# EAGLE design apc556fix (EAGLE 9.6.0)
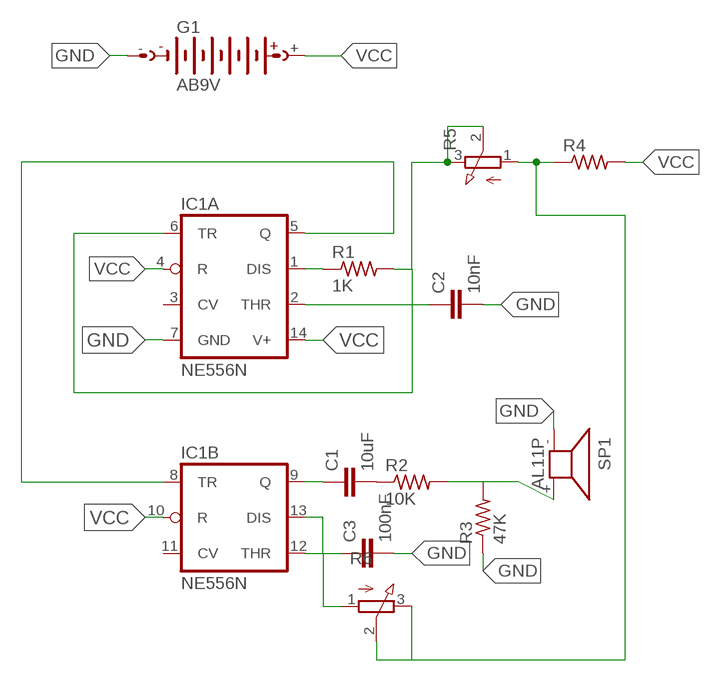
[diagram p0: schematic, sheet 1]

## Parts
C1  10uF  C-EU025-030X050  [C025-030X050]
C2  10nF  C-EU025-030X050  [C025-030X050]
C3  100nF  C-EU025-030X050  [C025-030X050]
G1  AB9V  [AB9V]
IC1  NE556N  [DIL14]
R1  1K  R-US_0204/5  [0204/5]
R2  10K  R-US_0204/7  [0204/7]
R3  47K  R-US_0204/7  [0204/7]
R4  R-US_0204/7  [0204/7]
R5  3RP/1610N  [3RP/1610N]
R6  3RP/1610N  [3RP/1610N]
SP1  AL11P  [AL11P]

## Nets
GND: C2.2 C3.2 G1.- IC1.7(A:GND) R3.1 SP1.-
N$1: IC1.5(A:Q) IC1.8(B:TR)
N$2: C2.1 IC1.2(A:THR) IC1.6(A:TR) R1.2 R5.2(S) R5.3(E)
N$3: IC1.1(A:DIS) R1.1
N$4: C1.1 IC1.9(B:Q)
N$5: C1.2 R2.1
N$6: R2.2 R3.2 SP1.+
N$7: C3.1 IC1.12(B:THR) IC1.13(B:DIS) R6.1(A)
N$9: R4.1 R5.1(A) R6.2(S) R6.3(E)
VCC: G1.+ IC1.4(A:R) IC1.10(B:R) IC1.14(A:V+) R4.2
Unconnected: IC1.3(A:CV) IC1.11(B:CV)

## Library data of the parts
C1-C3 = resistor:C-EU: CAPACITOR, European symbol
G1 = battery:AB9V: 9-V BATTERY CLIP
IC1 = linear:*556: Dual TIMER
R1-R4 = resistor:R-US_: RESISTOR, American symbol
R5 R6 = pot:3RP/1610N: 16mm Potentiometer one level Source: http://www.alphapotentiometers.net/html/16mm_pot_2.html
SP1 = buzzer:AL11P: SPEAKER Source: Buerklin; OC_FARNELL: unknown; OC_NEWARK: unknown

## Board
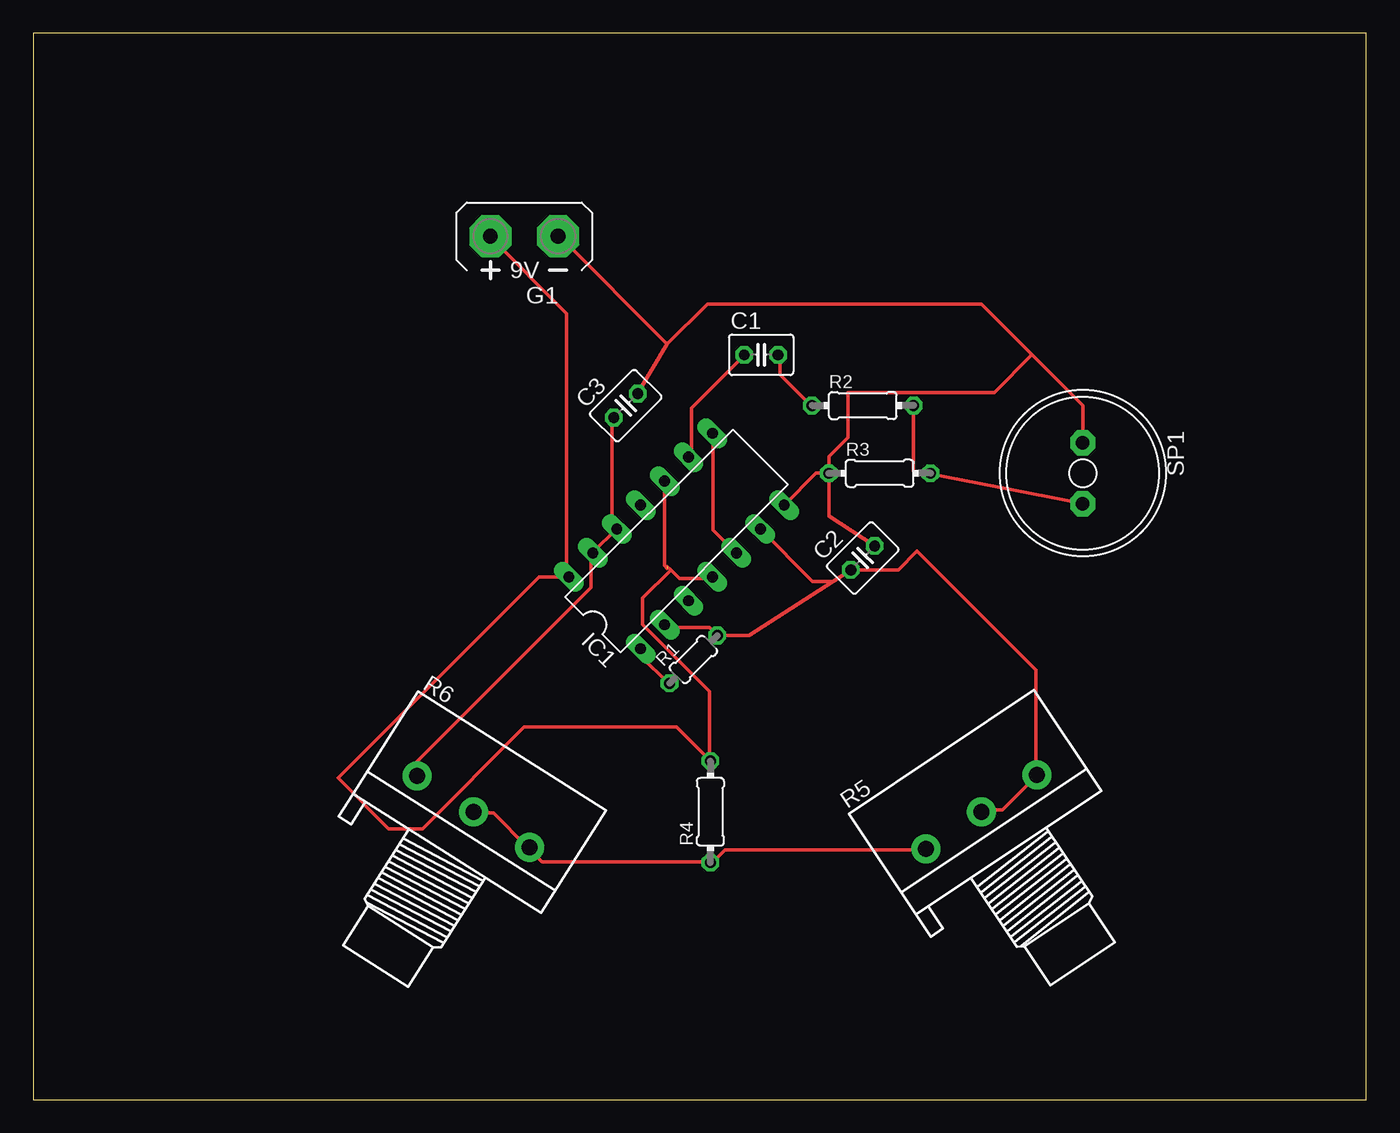
[diagram p1: board, top side]

Size 100 x 80 mm. Coordinates in mm from the lower left corner, seen from the top.
Outline: 0,0 100,0 100,80 0,80 0,0
Copper layers (1*16): Top 0.035mm / dielectric 1.5mm / Bottom 0.035mm
Design rules "default": minimum track width 10mil, minimum drill 24mil, track to track 8mil, track to pad 8mil, pad to pad 8mil, via to via 8mil, smd to smd 8mil, copper to edge 40mil, drill to drill 8mil, minimum pad ring 10mil, minimum via ring 8mil, stop-mask expansion 4mil, vias tented up to drill 0mil, thermal gap 10mil

### Footprints (pad centres in the part's own frame; a part is rotated, then mirrored left to right if it is on the bottom)
C025-030X050 = drill 0.813 octagon: 1 -1.27,0; 2 1.27,0
AB9V = drill 1.118 pad 3.15 octagon: + 0,2.54; - 0,-2.54
DIL14 = drill 0.813 long: 1 -7.62,-3.81; 2 -5.08,-3.81; 3 -2.54,-3.81; 4 0,-3.81; 5 2.54,-3.81; 6 5.08,-3.81; 7 7.62,-3.81; 8 7.62,3.81; 9 5.08,3.81; 10 2.54,3.81; 11 0,3.81; 12 -2.54,3.81; 13 -5.08,3.81; 14 -7.62,3.81
0204/5 = drill 0.813 octagon: 1 -2.54,0; 2 2.54,0
0204/7 = drill 0.813 octagon: 1 -3.81,0; 2 3.81,0
3RP/1610N = drill 1.2 pad 2.184: 1 -5,0; 2 0,0; 3 5,0
AL11P = drill 1.016 pad 1.905 octagon: + 2.286,0; - -2.286,0

### Placement (x,y rotation side)
C1  54.61,55.88 0 top
C2  62.23,40.64 45 top
C3  44.45,52.07 45 top
G1  36.83,64.77 90 top
IC1  48.26,41.91 45 top
R1  49.53,33.02 45 top
R2  62.23,52.07 0 top
R3  63.5,46.99 0 top
R4  50.8,21.59 90 top
R5  71.12,21.59 33.7 top
R6  33.02,21.59 327.6 top
SP1  78.74,46.99 270 top

### Tracks (layer width: path | path; a pad name or v marks a point on that pad's centre or on a via)
GND
  Top 0.254: 56.46,44.58 IC1.7 58.73,46.99 R3.1 | C2.2 59.69,43.79 R3.1 | 47.56,56.68 39.55,64.69 G1.- | 47.56,56.68 C3.2 45.49,52.88 | 47.56,56.68 50.56,59.69 71.12,59.69 74.93,55.88 | 74.93,55.88 78.74,52.07 SP1.- | 74.93,55.88 72.11,53.06 61.1,53.06 61.1,49.67 59.69,48.26 R3.1
N$1
  Top 0.254: IC1.8 50.98,49.84 50.98,42.75 52.58,41.15 IC1.5
N$2
  Top 0.254: R5.2 71.32,21.72 72.69,21.72 75.21,24.23 R5.3 75.21,24.46 75.21,32.23 66.29,41.15 64.89,39.74 | IC1.2 47.55,35.43 50.75,35.43 51.21,34.98 R1.2 53.7,34.82 60,38.88 | 54.63,42.98 IC1.6 58.47,38.88 60,38.88 | 64.89,39.74 | 64.89,39.74 C2.1 60,38.88
N$3
  Top 0.254: IC1.1 45.72,33.6 45.72,33.15 47.55,31.32 R1.1
N$4
  Top 0.254: IC1.9 49.38,48.23 49.38,51.89 53.26,55.78 C1.1
N$5
  Top 0.254: C1.2 56.01,55.78 56.01,54.41 58.29,52.12 R2.1
N$6
  Top 0.254: R2.2 66.04,47.15 R3.2 67.17,46.97 SP1.+
N$7
  Top 0.254: C3.1 43.43,51.05 43.43,43.2 43.66,42.98 IC1.12 43.66,42.75 42.06,41.15 IC1.13 41.83,40.92 41.83,38.41 28.8,25.38 28.8,24.46 R6.1
N$9
  Top 0.254: R6.2 33.15,21.49 34.52,21.49 37.03,18.97 R6.3 37.26,18.75 38.18,17.83 50.75,17.83 R4.1 50.98,17.83 51.89,18.75 66.75,18.75 R5.1
VCC  (1 unrouted)
  Top 0.254: 47.83,39.73 45.72,37.62 45.72,35.66 50.75,30.63 50.75,25.6 R4.2 48.26,27.94 36.83,27.94 29.21,20.32 26.67,20.32 22.86,24.13 37.95,39.22 IC1.14 40.01,39.32 40.01,58.98 34.29,64.69 G1.+ | IC1.4 50.75,39.09 48.46,39.09 47.83,39.73 | 47.83,39.73 47.55,40.01 | 47.55,39.83 47.36,40.05 IC1.10 47.32,46.41